# Altium schematic sheet Communication.SchDoc
size A3
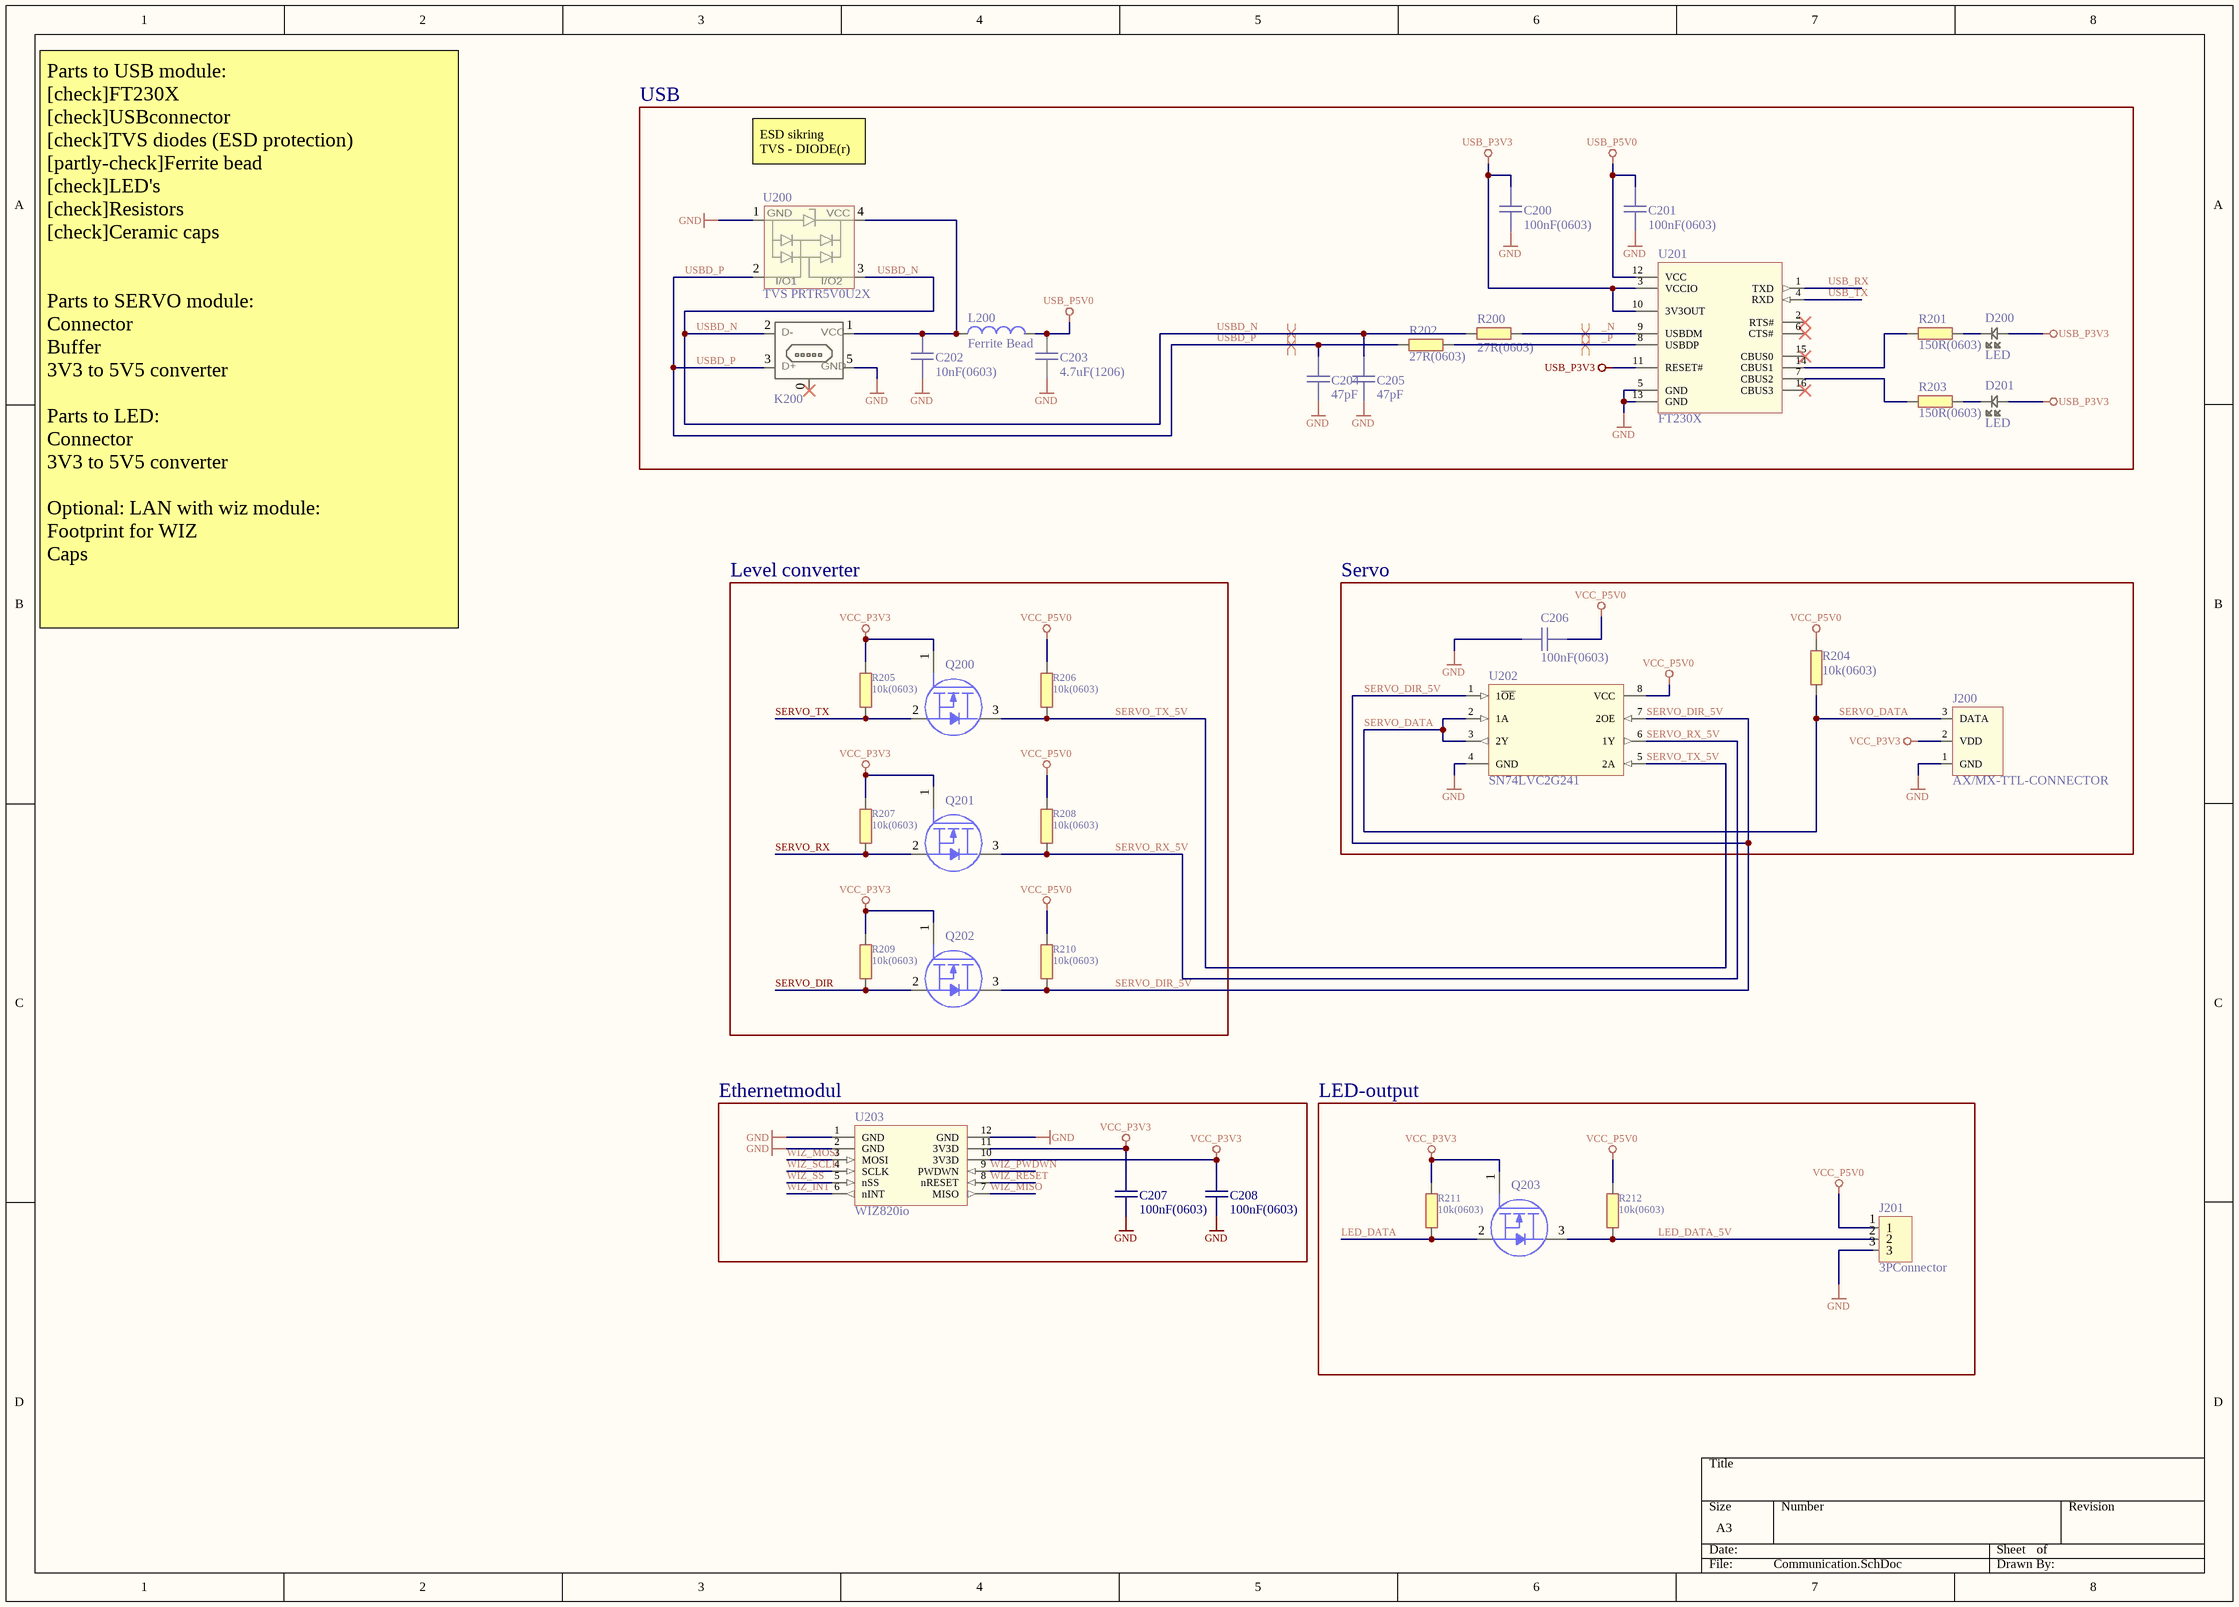
[diagram p0: Communication.SchDoc]

## Parts
C200  100nF(0603)  [CAPC0603(1608)55_N]
C201  100nF(0603)  [CAPC0603(1608)55_N]
C202  10nF(0603)  [CAPC0603(1608)55_N]
C203  4.7uF(1206)  [CAPC1206(3216)170_N]
C204  47pF  [CAPC0603(1608)55_N]
C205  47pF  [CAPC0603(1608)55_N]
C206  100nF(0603)  [CAPC0603(1608)55_N]
C207  100nF(0603)  [CAPC0603(1608)55_N]
C208  100nF(0603)  [CAPC0603(1608)55_N]
D200  LED  [I_LEDC0603(1608)_N]
D201  LED  [I_LEDC0603(1608)_N]
J200  AX/MX-TTL-CONNECTOR  [MOLEX_22-03-5035]
J201  3PConnector  [JST_3P]
K200  USB-OTG  [MILL-MAX_897-43-005-00-100001]  (value not drawn)
L200  Ferrite Bead  [0603]
Q200  MOSFET_N_GSD  [SOT323P130X100-3_N]  (value not drawn)
Q201  MOSFET_N_GSD  [SOT323P130X100-3_N]  (value not drawn)
Q202  MOSFET_N_GSD  [SOT323P130X100-3_N]  (value not drawn)
Q203  MOSFET_N_GSD  [SOT323P130X100-3_N]  (value not drawn)
R200  27R(0603)  [RESC0603(1608)_N]
R201  150R(0603)  [RESC0603(1608)_N]
R202  27R(0603)  [RESC0603(1608)_N]
R203  150R(0603)  [RESC0603(1608)_N]
R204  10k(0603)  [RESC0603(1608)_N]
R205  10k(0603)  [RESC0603(1608)_N]
R206  10k(0603)  [RESC0603(1608)_N]
R207  10k(0603)  [RESC0603(1608)_N]
R208  10k(0603)  [RESC0603(1608)_N]
R209  10k(0603)  [RESC0603(1608)_N]
R210  10k(0603)  [RESC0603(1608)_N]
R211  10k(0603)  [RESC0603(1608)_N]
R212  10k(0603)  [RESC0603(1608)_N]
U200  TVS PRTR5V0U2X  [SOT143B-M]
U201  FT230X  [SOP0635P4800-16N]
U202  SN74LVC2G241  [TSOP65P400X130-8N]
U203  WIZ820io  [Wiz820io]

## Blocks framed on the sheet
USB: C200-C205 D200 D201 K200 L200 R200-R203 U200 U201
Level converter: Q200-Q202 R205-R210
Servo: C206 J200 R204 U202
Ethernetmodul: C207 C208 U203
LED-output: J201 Q203 R211 R212

## Nets
GND: C200.1 C201.1 C202.1 C203.1 C204.1 C205.1 C206.1 C207.1 C208.1 J200.1(GND) J201.3 K200.5(GD) U200.1(GND) U201.5(GND) U201.13(GND) U202.4(GND) U203.1(GND) U203.2(GND) U203.12(GND)
USB_P3V3: C200.2 D200.1 D201.1 U201.3(VCCIO) U201.10(3V3OUT) U201.11(RESET#)
USB_P5V0: C201.2 C203.2 L200.2 U201.12(VCC)
VCC_P3V3: C207.2 C208.2 J200.2(VDD) Q200.1(Gate) Q201.1(Gate) Q202.1(Gate) Q203.1(Gate) R205.1 R207.1 R209.1 R211.1 U203.10(3V3D) U203.11(3V3D)
VCC_P5V0: C206.2 J201.1 R204.2 R206.1 R208.1 R210.1 R212.1 U202.8(VCC)
_N: R200.2 U201.9(USBDM)
_P: R202.2 U201.8(USBDP)
LED_DATA: Q203.2(Source) R211.2
LED_DATA_5V: J201.2 Q203.3(Drain) R212.2
SERVO_DATA: J200.3(DATA) R204.1 U202.2(1A) U202.3(2Y)
SERVO_DIR: Q202.2(Source) R209.2
SERVO_DIR_5V: Q202.3(Drain) R210.2 U202.1(1~{OE}) U202.7(2OE)
SERVO_RX: Q201.2(Source) R207.2
SERVO_RX_5V: Q201.3(Drain) R208.2 U202.6(1Y)
SERVO_TX: Q200.2(Source) R205.2
SERVO_TX_5V: Q200.3(Drain) R206.2 U202.5(2A)
USB_RX: U201.1(TXD)
USB_TX: U201.4(RXD)
USBD_N: C205.2 K200.2(D-) R200.1 U200.3(I/O2)
USBD_P: C204.2 K200.3(D+) R202.1 U200.2(I/O1)
WIZ_INT: U203.6(nINT)
WIZ_MISO: U203.7(MISO)
WIZ_MOSI: U203.3(MOSI)
WIZ_PWDWN: U203.9(PWDWN)
WIZ_RESET: U203.8(nRESET)
WIZ_SCLK: U203.4(SCLK)
WIZ_SS: U203.5(nSS)
NetC202_2: C202.2 K200.1(VB) L200.1 U200.4(VCC)
NetD200_2: D200.2 R201.1
NetD201_2: D201.2 R203.1
NetR201_2: R201.2 U201.14(CBUS1)
NetR203_2: R203.2 U201.7(CBUS2)

Not connected (* = marked no-connect by the designer): K200 0(Shield)*; U201 2(RTS#)* 6(CTS#)* 15(CBUS0)* 16(CBUS3)*

## Layout directives
differential pair: _N, _P, USBD_N, USBD_P

## Notes on the sheet
- (near U200) ESD sikring
  TVS - DIODE(r)
- Parts to USB module:
  [check]FT230X
  [check]USBconnector
  [check]TVS diodes (ESD protection)
  [partly-check]Ferrite bead
  [check]LED's
  [check]Resistors
  [check]Ceramic caps
  Parts to SERVO module:
  Connector
  Buffer
  3V3 to 5V5 converter
  Parts to LED:
  Connector
  3V3 to 5V5 converter
  Optional: LAN with wiz module:
  Footprint for WIZ
  Caps
- (in symbol MILL-MAX_897-43-005-00-100001) VCC; GND

## Library data of the parts
C200 C201 C206-C208 = 100nF(0603): 100nF 0603 5% X7R 50V; pakke_opprettet_av: 815; pris: 1; nokkelord: Kondensator, Capacitor, CAP; pakketype: 93; id: 3028; navn: 100nF(0603); pakke_opprettet: 18.02.2015 14:18:13; symbol_opprettet_av: 815; symbol_opprettet: 14.11.2014 20:19:34
C202 = 10nF(0603): 0603 5% NP0 50V; pakke_opprettet_av: 815; pris: 1; nokkelord: Capacitor Cap Kondis; pakketype: 93; id: 3035; navn: 10nF(0603); pakke_opprettet: 18.02.2015 14:18:13; symbol_opprettet_av: 815; symbol_opprettet: 14.11.2014 20:19:34
C203 = 4.7uF(1206): 1206 chip X7R 50V; pakke_opprettet_av: 815; pris: 1; nokkelord: Kondensator, capacitor; pakketype: 95; produsent: Multikomp; id: 2992; navn: 4.7uF(1206); pakke_opprettet: 11.02.2015 13:21:22; symbol_opprettet_av: 815; symbol_opprettet: 14.11.2014 20:19:34
C204 C205 = 47pF: 0603 5% NP0 50V; pakke_opprettet_av: 815; pris: 1; nokkelord: Capacitor Cap Kondis; pakketype: 93; id: 3034; navn: 47pF; pakke_opprettet: 18.02.2015 14:18:13; symbol_opprettet_av: 815; symbol_opprettet: 14.11.2014 20:19:34
D200 D201 = SMD LED Red: SMD; rad: 0; rom: OV; lager_type: Fremlager; dybde: 2; hylle: 13; antall: 50; pakke_opprettet_av: 815; leverandor_varenr: 8554641; pris: 1; pakketype: 93; produsent: Avago; leverandor: Farnell; id: 2209; navn: SMD LED Red; kolonne: 0; pakke_opprettet: 06.07.2014 18:55:44; symbol_opprettet_av: 815; symbol_opprettet: 06.07.2014 18:59:47; nokkelord: SMD
J200 = AX/MX-TTL-CONNECTOR: Dynamixel AX/MX-Series servo connector 3 pin TTL version; Manufaturer: MOLEX; MPN: 22-03-5035; Pinout: http://support.robotis.com/en/product/dynamixel/dxl_connector.htm; Farnell: 9979620
J201 = JST 3pin: pris pr. stk.; pakke_opprettet_av: 815; pris: 2; nokkelord: Connector, Kontakt; pakketype: 92; id: 2226; navn: JST 3pin; pakke_opprettet: 28.06.2014 18:25:12; symbol_opprettet_av: 815; symbol_opprettet: 28.06.2014 15:33:24
K200 = MILL-MAX_897-43-005-00-100001: MINI USB B DEVICE CONNECTOR MOLEX 51387-0571; Manufacturer: Mill-Max Manufacturing Corp.; Digi-Key: ED90341CT-ND; MPN: 897-43-005-00-100001; Farnell: 1925220
L200 = BLM18SG331TN1D: Ferrite Bead 0603; Farnell: 1515756RL; MPN: BLM18SG331TN1D; Digi-Key: 490-3997-1-ND
Q200-Q203 = 2N7002: N-Channel MOSFET 300mA; navn: 2N7002; leverandor: Farnell; pakke_opprettet_av: 815; symbol_opprettet_av: 774; leverandor_varenr: 1829184; pris: 2; pakketype: 101; pakke_opprettet: 13.11.2014 18:21:11; symbol_opprettet: 11.07.2014 23:17:04
R200 R202 = 3033: 0603 0.1W 1% Thick film resistor; id: 3033; pakke_opprettet_av: 815; symbol_opprettet_av: oystesm; pris: 0; nokkelord: Motstand, Resistor; pakketype: 93; pakke_opprettet: 08.07.2014 21:15:30; symbol_opprettet: 08.07.2014 21:16:33; navn: 27R(0603)
R201 R203 = 3031: 0603 0.1W 1% Thick film resistor; id: 3031; pakke_opprettet_av: 815; symbol_opprettet_av: oystesm; pris: 0; nokkelord: Motstand, Resistor; pakketype: 93; produsent: Multikomp; pakke_opprettet: 08.07.2014 21:15:30; symbol_opprettet: 08.07.2014 21:16:33; navn: 150R(0603)
R204 = 2444: 10k 0603 0.1W 1% Thick film resistor; id: 2444; rad: -1; rom: OV; lager_type: Fremlager; dybde: 72; hylle: 6; antall: 100; kolonne: 0; pakke_opprettet_av: 815; symbol_opprettet_av: oystesm; nokkelord: Resistor Motstand; pakketype: 93; pakke_opprettet: 08.07.2014 21:15:30; symbol_opprettet: 08.07.2014 21:16:33; navn: 10k(0603); pris: 0
R205-R212 = 2444: 10k 0603 0.1W 1% Thick film resistor; rad: -1; rom: OV; lager_type: Fremlager; dybde: 72; hylle: 6; antall: 100; kolonne: 0; pakke_opprettet_av: 815; symbol_opprettet_av: oystesm; nokkelord: Resistor Motstand; pakketype: 93; id: 2444; navn: 10k(0603); pakke_opprettet: 08.07.2014 21:15:30; symbol_opprettet: 08.07.2014 21:16:33; pris: 0
U200 = PRTR5V0U2X: TVS Didode dual PRTR5V0U2X; Manufacturer: NXP; MPN: PRTR5V0U2X; Farnell Pn: 1524157; Digi-Key: 568-4140-1-ND
U201 = FT230X: IC USB SERIAL BASIC UART 16SSOP; MPN: FT230XS-R; Manufacturer: FTDI, Future Technology Devices International Ltd; Digi-Key: 768-1135-1-ND; Farnell: 2081321
U202 = SN74LVC2G241: Dual  Buffer/Driver  With  3-State  Outputs, designed for 1.65-5.5Vcc operation; Manufacturer: Texas Instruments; MPN: SN74LVC2G241DCUR; Farnell: 2437234
U203 = WIZ820io: WIZ820io, Ethernet module with W5200 module onboard and MAG-JACK; Manufacturer: WIZnet; MPN: WIZ820IO; Digi-Key: 1278-1015-ND